# EAGLE design LPC1114_LedMatrix (EAGLE 7.5.0)
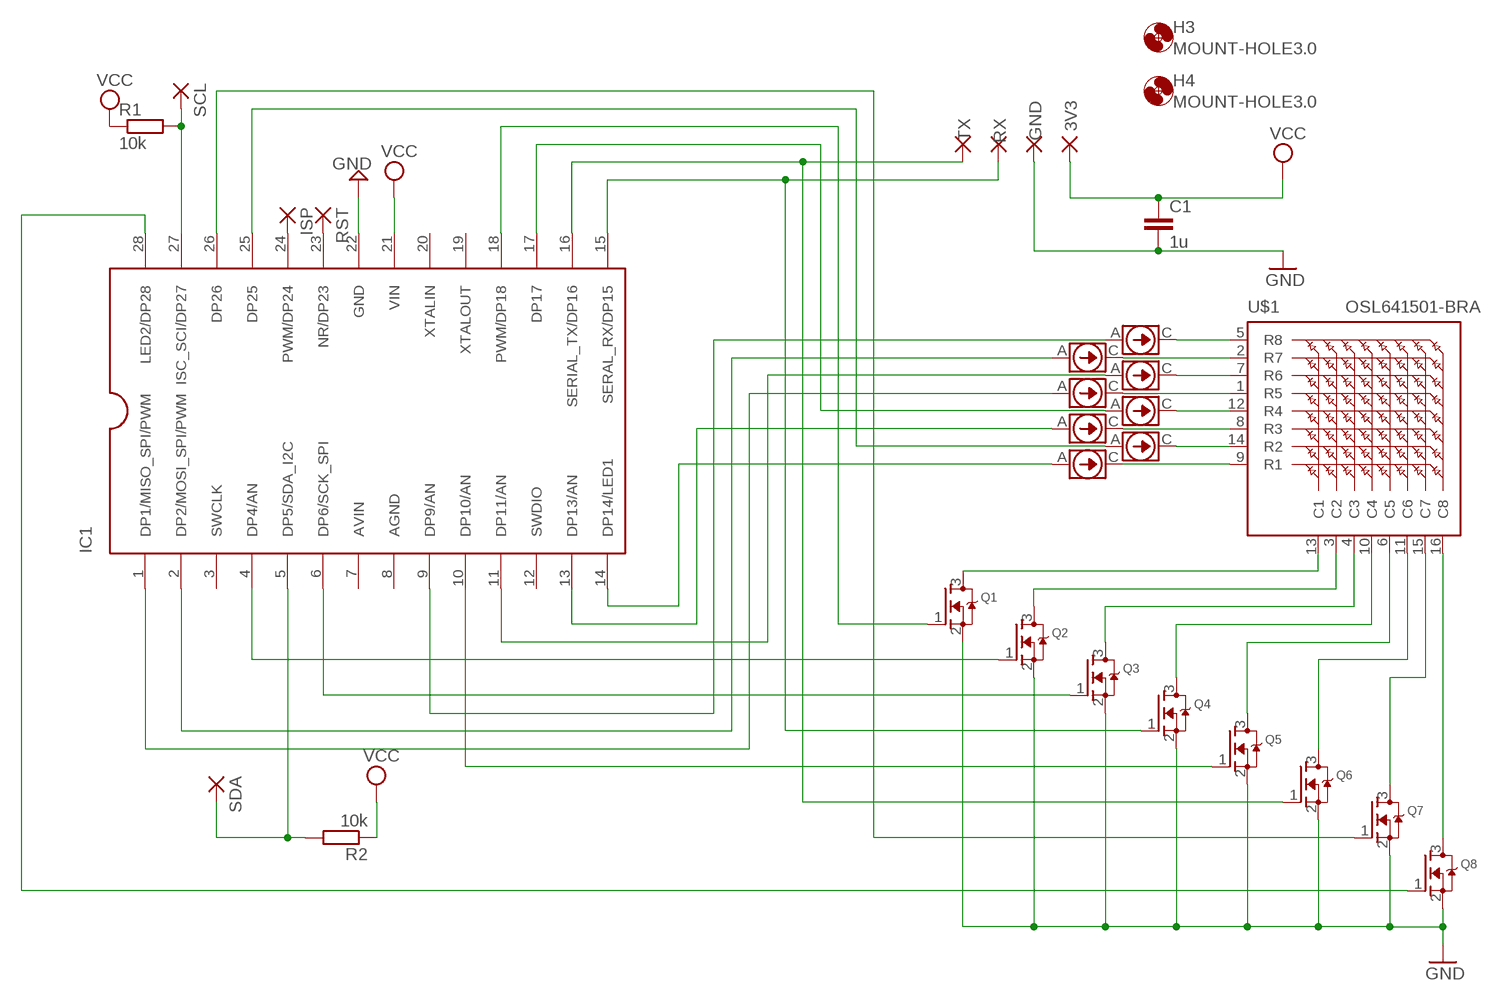
[diagram p0: schematic, sheet 1]

## Parts
3V3  1,6/0,8  [1,6/0,8]
C1  1u  C-EUC0603  [C0603]
CRD1  NSI45020AT1G  [SOD-123]
CRD2  NSI45020AT1G  [SOD-123]
CRD3  NSI45020AT1G  [SOD-123]
CRD4  NSI45020AT1G  [SOD-123]
CRD5  NSI45020AT1G  [SOD-123]
CRD6  NSI45020AT1G  [SOD-123]
CRD7  NSI45020AT1G  [SOD-123]
CRD8  NSI45020AT1G  [SOD-123]
GND  1,6/0,8  [1,6/0,8]
H3  MOUNT-HOLE3.0  [3,0]
H4  MOUNT-HOLE3.0  [3,0]
IC1  LPC1114FN28  [DIP28]
ISP  1,6/0,8  [1,6/0,8]
Q1  MOSFET-NREFLOW  [SOT23]
Q2  MOSFET-NREFLOW  [SOT23]
Q3  MOSFET-NREFLOW  [SOT23]
Q4  MOSFET-NREFLOW  [SOT23]
Q5  MOSFET-NREFLOW  [SOT23]
Q6  MOSFET-NREFLOW  [SOT23]
Q7  MOSFET-NREFLOW  [SOT23]
Q8  MOSFET-NREFLOW  [SOT23]
R1  10k  R-EU_R0603  [R0603]
R2  10k  R-EU_R0603  [R0603]
RST  1,6/0,8  [1,6/0,8]
RX  1,6/0,8  [1,6/0,8]
SCL  1,6/0,8  [1,6/0,8]
SDA  1,6/0,8  [1,6/0,8]
TX  1,6/0,8  [1,6/0,8]
U$1  OSL641501-BRA  [OSL641501]

## Nets
GND [GND]: C1.2 GND.1(P) IC1.22(GND) Q1.2(S) Q2.2(S) Q3.2(S) Q4.2(S) Q5.2(S) Q6.2(S) Q7.2(S) Q8.2(S)
N$1: CRD8.C U$1.5(R8)
N$2: IC1.10(DP10/AN) Q5.1(G)
N$3: CRD7.C U$1.2(R7)
N$4: CRD1.A IC1.14(DP14/LED1)
N$5: CRD6.C U$1.7(R6)
N$6: IC1.4(DP4/AN) Q2.1(G)
N$7: IC1.6(DP6/SCK_SPI) Q3.1(G)
N$8: CRD5.C U$1.1(R5)
N$9: IC1.5(DP5/SDA_I2C) R2.2 SDA.1(P)
N$10: IC1.28(LED2/DP28) Q8.1(G)
N$11: CRD6.A IC1.11(DP11/AN)
N$12: CRD4.C U$1.12(R4)
N$13: IC1.15(SERAL_RX/DP15) Q4.1(G) RX.1(P)
N$14: CRD3.C U$1.8(R3)
N$15: CRD7.A IC1.2(DP2/MOSI_SPI/PWM)
N$16: CRD5.A IC1.1(DP1/MISO_SPI/PWM)
N$17: IC1.24(PWM/DP24) ISP.1(P)
N$18: IC1.23(NR/DP23) RST.1(P)
N$19: Q8.3(D) U$1.16(C8)
N$20: Q1.3(D) U$1.13(C1)
N$21: CRD2.C U$1.14(R2)
N$22: CRD1.C U$1.9(R1)
N$23: CRD3.A IC1.13(DP13/AN)
N$24: Q2.3(D) U$1.3(C2)
N$25: IC1.16(SERIAL_TX/DP16) Q6.1(G) TX.1(P)
N$26: IC1.27(ISC_SCI/DP27) R1.2 SCL.1(P)
N$27: Q3.3(D) U$1.4(C3)
N$28: CRD8.A IC1.9(DP9/AN)
N$29: Q4.3(D) U$1.10(C4)
N$30: Q5.3(D) U$1.6(C5)
N$32: IC1.26(DP26) Q7.1(G)
N$33: CRD2.A IC1.25(DP25)
N$35: IC1.18(PWM/DP18) Q1.1(G)
N$36: Q7.3(D) U$1.15(C7)
N$37: CRD4.A IC1.17(DP17)
N$38: Q6.3(D) U$1.11(C6)
VCC [Power]: 3V3.1(P) C1.1 IC1.21(VIN) R1.1 R2.1
Unconnected: IC1.3(SWCLK) IC1.12(SWDIO) IC1.19(XTALOUT) IC1.20(XTALIN)

## Power pins joined to a net without a drawn wire
AGND: IC1.8(AGND)
AVIN: IC1.7(AVIN)

## Library data of the parts
3V3 GND ISP RST RX SCL SDA TX = wirepad:1,6/0,8: THROUGH-HOLE PAD
C1 = resistor:C-EU: CAPACITOR, European symbol
CRD1-CRD8 = akizuki:NSI45020AT1G: CRD/CCR SOD-123 package 20mA constant current regurator
H3 H4 = holes:MOUNT-HOLE: MOUNTING HOLE with drill center marker
IC1 = lpc1114fn28:LPC1114FN28
Q1-Q8 = adafruit:MOSFET-N: N-Channel Mosfet 2N7002E - 60V 260mA SOT23 [Digikey: 2N7002ET1GOSTR-ND] - REEL BSH103 - 30V 850mA SOT23 [Digikey: 568-5013-1-ND]
R1 R2 = resistor:R-EU_: RESISTOR, European symbol
U$1 = display-kingbright_3:OSL641501-BRA

## Net classes
1 GND: width 0.61 mm
2 Power: width 0.61 mm

## Board
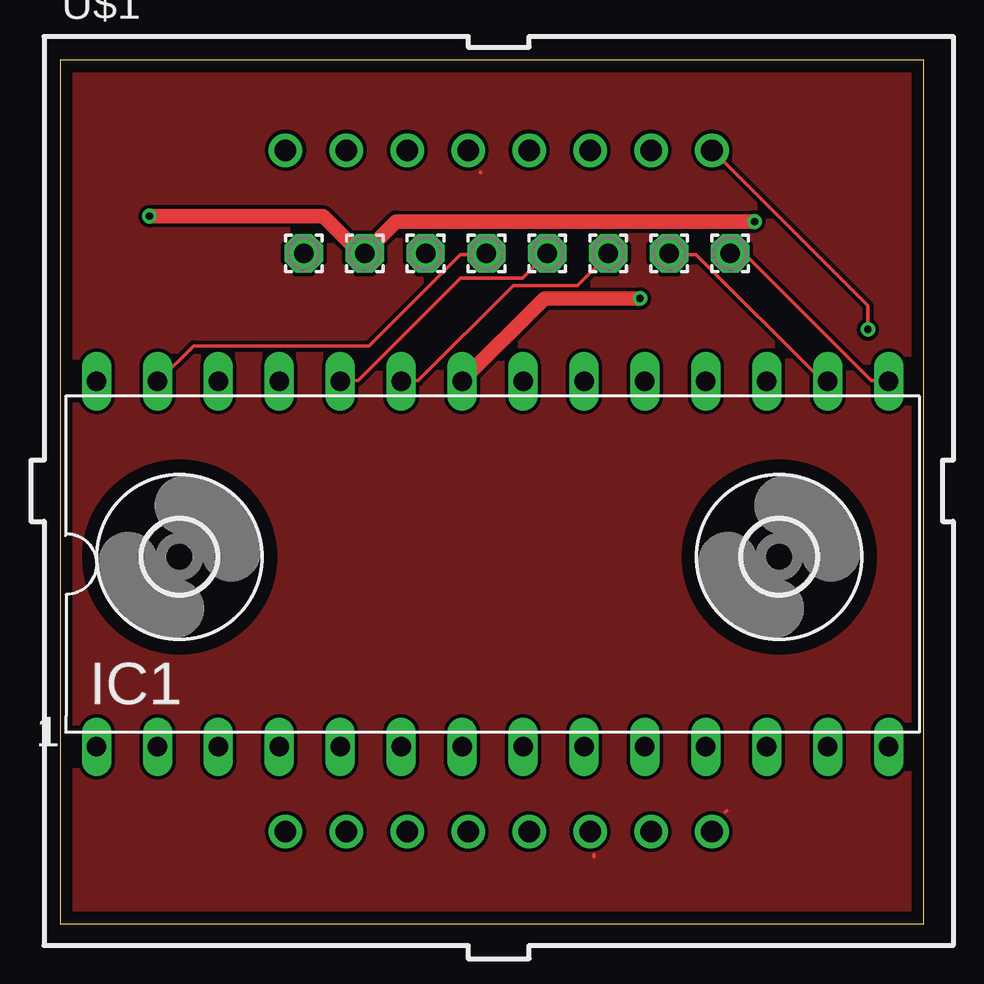
[diagram p1: board, top side]
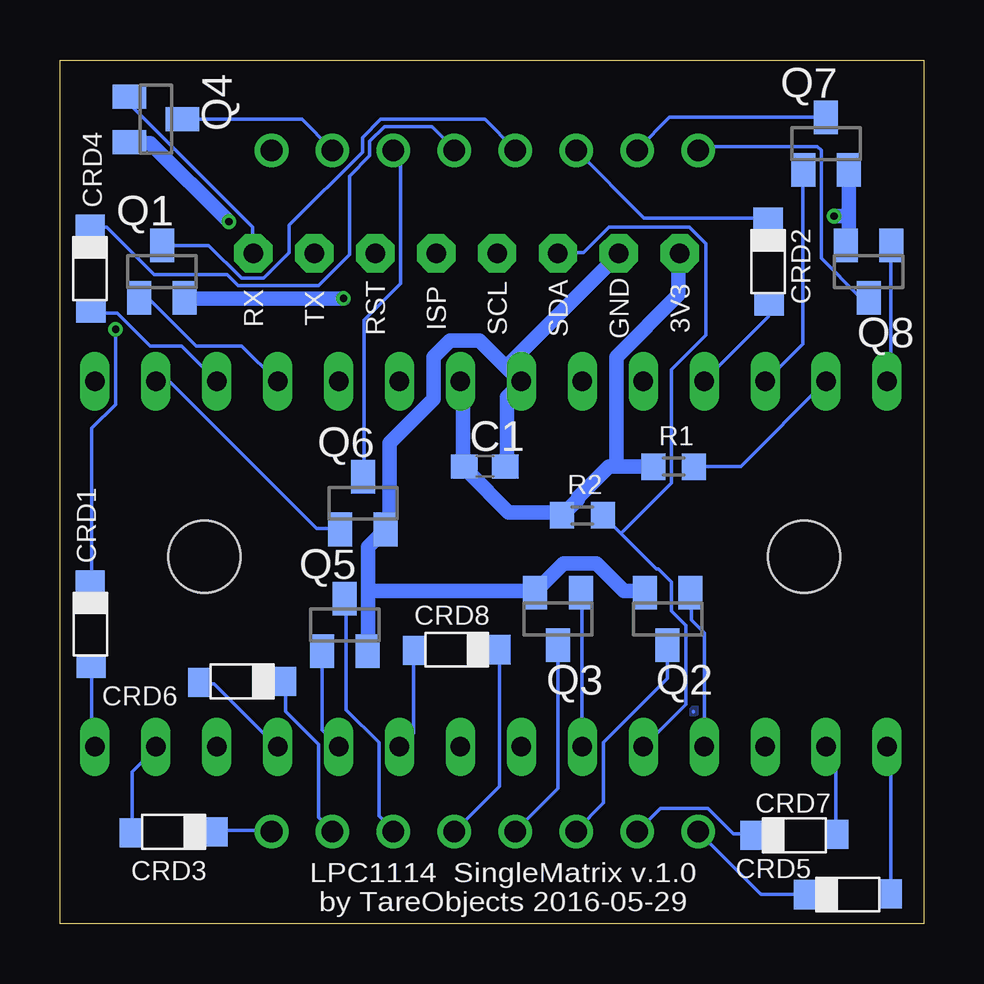
[diagram p2: board, bottom side, seen from below]

Size 36 x 36 mm. Coordinates in mm from the lower left corner, seen from the top.
Outline: 0,0 36,0 36,36 0,36 0,0
Copper layers (1*16): Top 0.035mm / dielectric 1.6mm / Bottom 0.035mm
Design rules "Elecrow_2-layer_PCB_eagle_rule": minimum track width 6mil, minimum drill 12mil, track to track 6mil, track to pad 6mil, pad to pad 6mil, via to via 8mil, smd to smd 0mil, copper to edge 20mil, drill to drill 10mil, minimum pad ring 6mil, minimum via ring 6mil, stop-mask expansion 0mil, vias tented up to drill 100mil, thermal gap 10mil

### Footprints (pad centres in the part's own frame; a part is rotated, then mirrored left to right if it is on the bottom)
1,6/0,8 = drill 0.813 pad 1.6 octagon: 1 0,0
C0603 = smd 1.1 x 1: 1 -0.85,0; 2 0.85,0
SOD-123 = smd 0.91 x 1.22: A 1.75,0.04; C -1.835,0
3,0 = hole 3: 0,0
DIP28 = drill 0.813 long: 1 -16.51,-7.62; 2 -13.97,-7.62; 3 -11.43,-7.62; 4 -8.89,-7.62; 5 -6.35,-7.62; 6 -3.81,-7.62; 7 -1.27,-7.62; 8 1.27,-7.62; 9 3.81,-7.62; 10 6.35,-7.62; 11 8.89,-7.62; 12 11.43,-7.62; 13 13.97,-7.62; 14 16.51,-7.62; 15 16.51,7.62; 16 13.97,7.62; 17 11.43,7.62; 18 8.89,7.62; 19 6.35,7.62; 20 3.81,7.62; 21 1.27,7.62; 22 -1.27,7.62; 23 -3.81,7.62; 24 -6.35,7.62; 25 -8.89,7.62; 26 -11.43,7.62; 27 -13.97,7.62; 28 -16.51,7.62
SOT23 = smd 1 x 1.4: 1 -0.95,-1.1; 2 0.95,-1.1; 3 0,1.1
R0603 = smd 1 x 1.1: 1 -0.85,0; 2 0.85,0
OSL641501 = drill 0.9 pad 1.4: 1 -8.89,-14.2; 2 -6.35,-14.2; 3 -3.81,-14.2; 4 -1.27,-14.2; 5 1.27,-14.2; 6 3.81,-14.2; 7 6.35,-14.2; 8 8.89,-14.2; 9 8.89,14.2; 10 6.35,14.2; 11 3.81,14.2; 12 1.27,14.2; 13 -1.27,14.2; 14 -3.81,14.2; 15 -6.35,14.2; 16 -8.89,14.2

### Placement (x,y rotation side)
3V3  10.16,27.94 0 top
C1  18.29,19.05 0 bottom
CRD1  34.74,12.44 270 bottom
CRD2  6.48,27.56 270 bottom
CRD3  31.3,3.82 180 bottom
CRD4  34.74,27.27 270 bottom
CRD5  3.11,1.2 0 bottom
CRD6  28.45,10.09 180 bottom
CRD7  5.34,3.68 0 bottom
CRD8  19.5,11.42 180 bottom
GND  12.7,27.94 0 top
H3  4.98,15.29 0 top
H4  29.98,15.29 0 top
IC1  18.03,14.99 0 top
ISP  20.32,27.94 0 top
Q1  31.75,27.18 0 bottom
Q2  10.67,12.7 180 bottom
Q3  15.24,12.7 180 bottom
Q4  32,33.53 270 bottom
Q5  24.13,12.45 0 bottom
Q6  23.37,17.53 0 bottom
Q7  4.06,32.51 0 bottom
Q8  2.29,27.18 180 bottom
R1  10.41,19.05 0 bottom
R2  14.22,17.02 0 bottom
RST  22.86,27.94 0 top
RX  27.94,27.94 0 top
SCL  17.78,27.94 0 top
SDA  15.24,27.94 0 top
TX  25.4,27.94 0 top
U$1  18.29,18.03 0 top

### Tracks (layer width: path | path; a pad name or v marks a point on that pad's centre or on a via)
GND  (via drill 0.3)
  Top 0.61: v24.18,26.06 20.19,26.06 16.76,22.63 IC1.22 | v28.96,29.26 14.02,29.26 GND.1 12.42,28.04 10.97,29.49 v3.73,29.49
  Bottom 0.61: Q2.2 11.66,13.87 12.5,13.87 13.64,15.01 15.01,15.01 16.15,13.87 Q3.2 16.46,13.87 23.16,13.87 | 23.16,13.87 23.16,15.7 22.48,16.38 Q6.2 22.25,16.69 22.25,20.04 20.42,21.87 20.42,23.62 19.74,24.31 18.52,24.31 16.99,22.78 IC1.22 | 23.16,13.87 23.16,11.35 Q5.2 | C1.2 17.37,19.05 17.37,21.95 16.76,22.55 IC1.22 | v24.18,26.06 30.79,26.06 Q1.2 | 3.12,29.49 3.12,28.42 3.2,28.35 Q8.2 | 3.12,29.49 3.12,31.39 Q7.2 | v28.96,29.26 32.23,32.54 33.07,32.54 Q4.2 | v3.73,29.49 3.12,29.49 | IC1.22 17.22,23.39 12.72,27.89 GND.1
N$1
  Bottom 0.152: CRD8.C 17.68,11.35 17.68,5.71 19.51,3.89 U$1.5
N$2
  Bottom 0.152: Q5.1 25.07,11.28 25.07,8.08 24.38,7.39 IC1.10
N$3
  Bottom 0.152: CRD7.C 7.24,3.73 7.92,3.73 8.99,4.8 10.97,4.8 11.89,3.89 U$1.2
N$4
  Bottom 0.152: CRD1.A 34.67,10.67 34.67,7.47 34.59,7.39 IC1.14
N$5
  Bottom 0.152: CRD6.C 26.59,10.06 26.59,8.84 25.22,7.47 25.22,4.42 24.69,3.89 U$1.7
N$6
  Bottom 0.152: IC1.4 9.14,12.12 9.68,12.65 9.68,13.79 Q2.1
N$7
  Bottom 0.152: Q3.1 14.25,13.79 14.25,7.39 IC1.6
N$8
  Bottom 0.152: CRD5.C 4.95,1.22 6.78,1.22 9.37,3.81 U$1.1
N$9
  Bottom 0.152: 12.61,16.27 11.12,14.78 11.05,14.78 10.52,14.25 10.52,13.03 9.91,12.42 9.91,9.14 IC1.5 | 12.61,16.27 13.34,16.99 R2.2 | 12.61,16.27 10.52,18.36 10.52,23.09 9.07,24.54 9.07,28.35 9.75,29.03 13.11,29.03 14.17,27.96 15.24,27.96 SDA.1
N$10
  Bottom 0.152: Q8.1 1.37,28.27 1.37,22.78 1.52,22.63 IC1.28
N$11
  Bottom 0.152: CRD6.A 30.18,9.98 29.57,9.98 26.98,7.39 IC1.11
N$12
  Bottom 0.152: CRD4.C 34.67,29.03 34.06,29.03 32.08,27.05 29.03,27.05 28.57,26.59 25.22,26.59 23.93,27.89 23.93,31.17 23.09,32 23.09,32.61 22.48,33.22 20.5,33.22 19.58,32.31 U$1.12
N$13
  Top 0.152: IC1.15 34.52,22.63 33.83,22.63 28.57,27.89 27.96,27.89 RX.1
  Bottom 0.152: Q4.1 33.07,34.44 33.07,34.14 27.96,29.03 27.96,27.96 RX.1
N$14
  Bottom 0.152: CRD3.C 29.41,3.89 27.2,3.89 U$1.8
N$15
  Bottom 0.152: CRD7.A 3.66,3.73 3.66,6.93 4.04,7.32 IC1.2
N$16
  Bottom 0.152: CRD5.A 1.37,1.29 1.37,7.16 1.52,7.32 IC1.1
N$17
  Top 0.152: ISP.1 19.28,26.9 16.69,26.9 12.42,22.63 11.73,22.63 IC1.24
N$18
  Top 0.152: IC1.23 14.25,22.63 14.94,22.63 18.9,26.59 21.57,26.59 22.86,27.89 RST.1
N$19
  Bottom 0.152: Q8.3 2.29,26.14 2.67,26.14 4.27,27.74 4.27,32.23 4.42,32.38 9.3,32.38 9.37,32.31 U$1.16
N$20
  Bottom 0.152: Q1.3 31.7,28.27 29.79,28.27 28.42,26.9 27.51,26.9 26.44,27.96 26.44,29.11 23.39,32.16 23.39,32.77 22.63,33.53 18.29,33.53 17.07,32.31 U$1.13
N$21
  Bottom 0.152: CRD2.C 6.55,29.41 11.66,29.41 U$1.14
N$22  (via drill 0.3)
  Top 0.152: v33.68,24.77 33.68,25.76 27.2,32.23 U$1.9
  Bottom 0.152: v33.68,24.77 33.68,21.64 34.67,20.65 34.67,14.33 CRD1.C
N$23
  Bottom 0.152: CRD3.A 32.99,3.81 32.99,6.33 32,7.32 IC1.13
N$24
  Bottom 0.152: Q2.3 10.67,10.21 13.34,7.54 13.34,5.03 14.48,3.89 U$1.3
N$25
  Top 0.152: TX.1 25.45,27.89 26.52,27.89 31.77,22.63 32,22.63 IC1.16
  Bottom 0.152: Q6.1 24.38,16.46 25.3,16.46 31.39,22.55 32,22.55 IC1.16
N$26
  Top 0.152: SCL.1 17.75,27.89 16.69,27.89 12.88,24.08 5.56,24.08 4.12,22.63 IC1.27
  Bottom 0.152: R1.2 7.62,19.05 IC1.27
N$27
  Bottom 0.152: Q3.3 15.24,5.64 16.99,3.89 U$1.4
N$28
  Bottom 0.152: CRD8.A 21.26,11.35 21.26,7.92 21.79,7.39 IC1.9
N$29
  Bottom 0.152: Q4.3 25.91,33.53 24.69,32.31 U$1.10
N$30
  Bottom 0.152: Q5.3 24.08,13.49 24.08,8.91 22.71,7.54 22.71,4.5 22.1,3.89 U$1.6
N$31
  Bottom 0.152: 9.6,8.84 9.6,8.83
  pour Bottom: -1.27,-1.27 36.83,-1.27 36.83,36.83 -1.27,36.83
N$32
  Bottom 0.152: Q7.1 5.03,31.39 5.03,24.16 6.55,22.63 IC1.26
N$33
  Bottom 0.152: CRD2.A 6.48,25.76 6.48,25.3 9.14,22.63 IC1.25
N$35
  Bottom 0.152: Q1.1 32.69,26.06 32.31,26.06 30.33,24.08 28.42,24.08 26.98,22.63 IC1.18
N$36
  Bottom 0.152: Q7.3 4.12,33.6 10.59,33.6 11.89,32.31 U$1.15
N$37
  Bottom 0.152: IC1.17 30.94,24.08 32.23,24.08 33.6,25.45 34.67,25.45 CRD4.A
N$38
  Bottom 0.152: Q6.3 23.32,18.67 23.32,25.15 21.79,26.67 21.79,31.93 U$1.11
N$39
  Top 0.152: 27.74,4.65 27.8,4.71 | 17.53,31.32 17.53,31.3 | 22.25,2.9 22.25,2.78
  pour Top: -1.27,-1.27 38.1,-1.27 38.1,36.83 -1.27,36.83
VCC
  Bottom 0.61: R1.1 12.8,19.05 | 12.8,19.05 13.11,19.05 14.4,17.75 14.4,17.68 15.01,17.07 R2.1 15.32,17.14 17.3,17.14 18.97,18.82 C1.1 19.2,19.05 19.2,22.48 19.28,22.55 IC1.21 | 12.8,19.05 12.8,23.62 10.21,26.21 10.21,27.89 3V3.1

### Text on the board
bNames: LPC1114 SingleMatrix v.1.0 / by TareObjects 2016-05-29